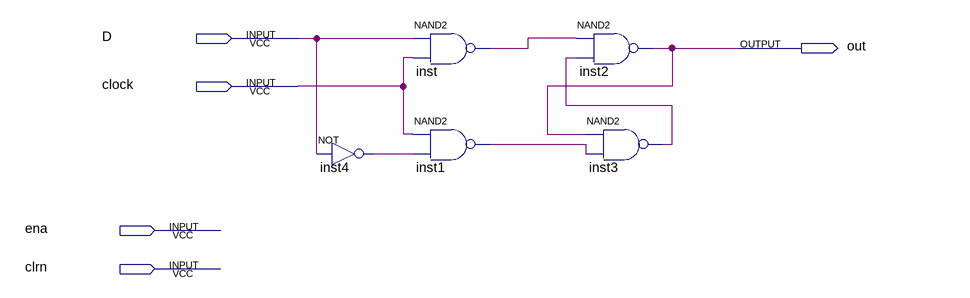
[diagram p0: schematic sheet]
// Quartus schematic ff-tipoD.bdf as structural Verilog: 5 symbols, 5 pins
module \ff-tipoD  (
  input  D,
  input  clock,
  input  ena,
  input  clrn,
  output out
);

  wire inst1_out, inst3_out, inst4_out, inst_out;

  not inst4 (inst4_out, D);
  nand inst (inst_out, D, clock);
  nand inst1 (inst1_out, clock, inst4_out);
  nand inst2 (out, inst_out, inst3_out);
  nand inst3 (inst3_out, out, inst1_out);
endmodule
